# EAGLE schematic AcceLog_v00 (EAGLE 7.3.0)
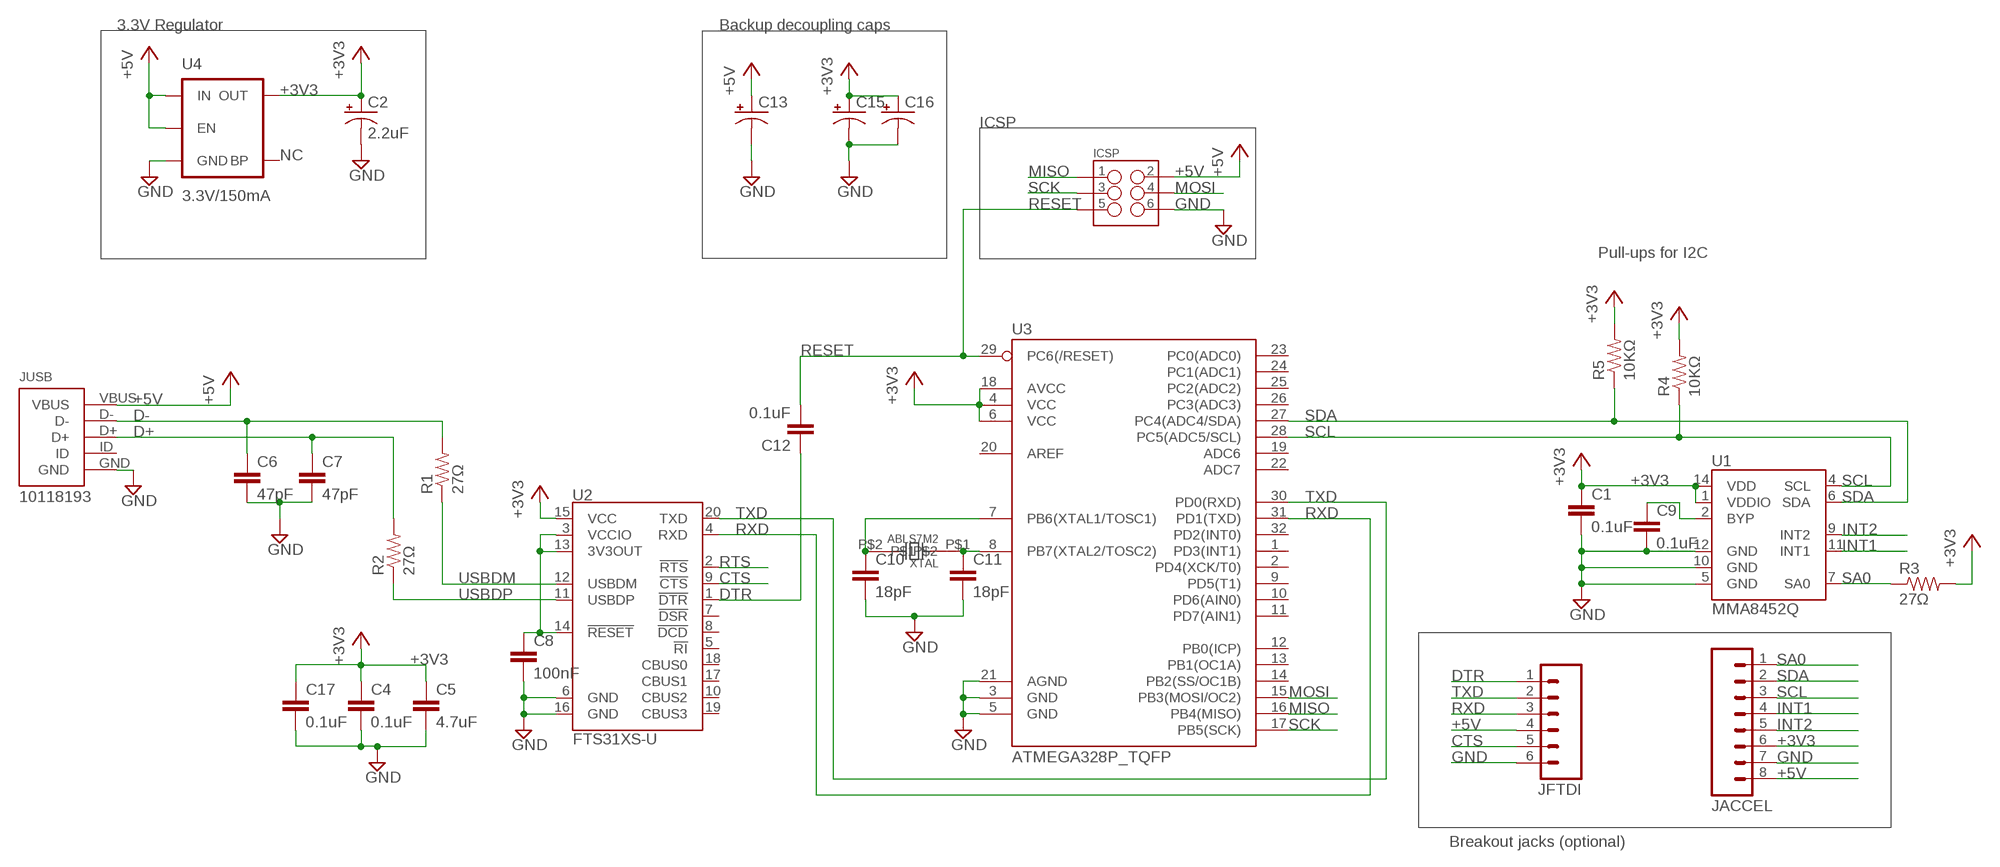
[diagram p0: schematic, sheet 1]

## Parts
C1  0.1uF  CAP0603-CAP  [0603-CAP]
C2  2.2uF  CAP_POL1206  [EIA3216]
C4  0.1uF  CAP0603-CAP  [0603-CAP]
C5  4.7uF  CAP0603-CAP  [0603-CAP]
C6  47pF  CAP0603-CAP  [0603-CAP]
C7  47pF  CAP0603-CAP  [0603-CAP]
C8  100nF  CAP0603-CAP  [0603-CAP]
C9  0.1uF  CAP0603-CAP  [0603-CAP]
C10  18pF  CAP0603-CAP  [0603-CAP]
C11  18pF  CAP0603-CAP  [0603-CAP]
C12  0.1uF  CAP0603-CAP  [0603-CAP]
C13  CPOL-USE2-5  [E2-5]
C15  CPOL-USE2-5  [E2-5]
C16  CPOL-USE2-5  [E2-5]
C17  0.1uF  CAP0603-CAP  [0603-CAP]
ICSP  M03X22X3_SILK_MALE_PTH  [2X3]
JACCEL  M08LOCK  [1X08_LOCK]
JFTDI  M06LOCK  [1X06_LOCK]
JUSB  10118193  [10118193]
R1  27Ω  RESISTOR0603-RES  [0603-RES]
R2  27Ω  RESISTOR0603-RES  [0603-RES]
R3  27Ω  RESISTOR0603-RES  [0603-RES]
R4  10KΩ  RESISTOR0603-RES  [0603-RES]
R5  10KΩ  RESISTOR0603-RES  [0603-RES]
U1  MMA8452Q  [QFN-16_0.5MM]
U2  FTS31XS-U  FT231XS  [SSOP20_L]
U3  ATMEGA328P_TQFP  [TQFP32-08]
U4  3.3V/150mA  V_REG_MIC52053.3V  [SOT23-5]
XTAL  ABLS7M2  [ABLS7M2]

## Nets
+3V3: C1.1 C2.A(+) C4.1 C5.1 C15.+ C16.+ C17.1 JACCEL.6 R3.2 R4.2 R5.2 U1.1(VDDIO) U1.14(VDD) U2.15(VCC) U3.4(VCC) U3.6(VCC) U3.18(AVCC) U4.5(OUT)
+5V: C13.+ ICSP.2 JACCEL.8 JFTDI.4 JUSB.VBUS U4.1(IN) U4.3(EN)
CTS: JFTDI.5 U2.9(!CTS)
D+: C7.1 JUSB.D+ R2.2
D-: C6.1 JUSB.D- R1.2
DTR: C12.1 JFTDI.1 U2.1(!DTR)
FTDI3V3: C8.1 U2.3(VCCIO) U2.13(3V3OUT) U2.14(!RESET)
GND: C1.2 C2.C(-) C4.2 C5.2 C6.2 C7.2 C8.2 C9.2 C10.2 C11.2 C13.- C15.- C16.- C17.2 ICSP.6 JACCEL.7 JFTDI.6 JUSB.GND U1.5(GND) U1.10(GND) U1.12(GND) U2.6(GND) U2.16(GND) U3.3(GND) U3.5(GND) U3.21(AGND) U4.2(GND)
INT1: JACCEL.4 U1.11(INT1)
INT2: JACCEL.5 U1.9(INT2)
MISO: ICSP.1 U3.16(PB4(MISO))
MOSI: ICSP.4 U3.15(PB3(MOSI/OC2))
N$10: C10.1 U3.7(PB6(XTAL1/TOSC1)) XTAL.P$2
N$11: C9.1 U1.2(BYP)
N$12: C11.1 U3.8(PB7(XTAL2/TOSC2)) XTAL.P$1
RESET: C12.2 ICSP.5 U3.29(PC6(/RESET))
RTS: U2.2(!RTS)
RXD: JFTDI.3 U2.4(RXD) U3.31(PD1(TXD))
SA0: JACCEL.1 R3.1 U1.7(SA0)
SCK: ICSP.3 U3.17(PB5(SCK))
SCL: JACCEL.3 R4.1 U1.4(SCL) U3.28(PC5(ADC5/SCL))
SDA: JACCEL.2 R5.1 U1.6(SDA) U3.27(PC4(ADC4/SDA))
TXD: JFTDI.2 U2.20(TXD) U3.30(PD0(RXD))
USBDM: R1.1 U2.12(USBDM)
USBDP: R2.1 U2.11(USBDP)
Unconnected: JUSB.ID U2.5(!RI) U2.7(!DSR) U2.8(!DCD) U2.10(CBUS2) U2.17(CBUS1) U2.18(CBUS0) U2.19(CBUS3) U3.1(PD3(INT1)) U3.2(PD4(XCK/T0)) U3.9(PD5(T1)) U3.10(PD6(AIN0)) U3.11(PD7(AIN1)) U3.12(PB0(ICP)) U3.13(PB1(OC1A)) U3.14(PB2(SS/OC1B)) U3.19(ADC6) U3.20(AREF) U3.22(ADC7) U3.23(PC0(ADC0)) U3.24(PC1(ADC1)) U3.25(PC2(ADC2)) U3.26(PC3(ADC3)) U3.32(PD2(INT0)) U4.4(BP)

## Notes on the sheet
- 3.3V Regulator | Backup decoupling caps
- ICSP
- NC
- Pull-ups for I2C
- Breakout jacks (optional)

## Library data of the parts
C1 C4-C12 C17 = SparkFun-Passives:CAP: Capacitor Standard 0603 ceramic capacitor, and 0.1" leaded capacitor.
C2 = SparkFun-Capacitors:CAP_POL: Capacitor Polarized These are standard SMD and PTH capacitors. Normally 10uF, 47uF, and 100uF in electrolytic and tantalum varieties. Always verify the external diameter of the through hole cap, it varies with capacity, voltage, and manufacturer. The EIA devices should be standard.
C13 C15 C16 = rcl:CPOL-US: POLARIZED CAPACITOR, American symbol
ICSP = SparkFun-Connectors:M03X2: 2x3 .1" header. Shrouded, with keying- CONN-10681 SMT- CONN-11415 Pogo pins- HW-11044; PROD_ID: CONN-09701
JACCEL = SparkFun-Connectors:M08: Header 8 Standard 8-pin 0.1" header. Use with straight break away headers (SKU : PRT-00116), right angle break away headers (PRT-00553), swiss pins (PRT-00743), machine pins (PRT-00117), and female headers (PRT-00115).
JFTDI = SparkFun-Connectors:M06: Header 6 Standard 6-pin 0.1" header. Use with straight break away headers (SKU : PRT-00116), right angle break away headers (PRT-00553), swiss pins (PRT-00743), machine pins (PRT-00117), and female headers (PRT-00115). Molex polarized connector foot print use with SKU : PRT-08094 with associated crimp pins and housings. NOTES ON THE VARIANTS LOCK and LOCK_LONGPADS... This footprint was designed to help hold the alignment of a through-hole component (i.e. 6-pin header) while soldering it into place. You may notice that each hole has been shifted either up or down by 0.005 of an inch from it's more standard position (which is a perfectly straight line). This slight alteration caused the pins (the squares in the middle) to touch the edges of the holes. Because they are alternating, it causes a "brace" to hold the component in place. 0.005 has proven to be the perfect amount of "off-center" position when using our standard breakaway headers. Although looks a little odd when you look at the bare footprint, once you have a header in there, the alteration is very hard to notice. Also,if you push a header all the way into place, it is covered up entirely on the bottom side. This idea of altering the position of holes to aid alignment will be further integrated into the Sparkfun Library for other footprints. It can help hold any component with 3 or more connection pins.
JUSB = MicroUSB:10118193: Micro USB B Jack for Surface Mount; MPN: 10118193; OC_DIGIKEY: 609-4616-1-ND; WEBSITE: http://www.digikey.com/product-detail/en/10118193-0001LF/609-4616-1-ND/2785380
R1-R5 = SparkFun-Passives:RESISTOR: Resistor Basic schematic elements and footprints for 0603, 1206, and PTH resistors.
U1 = SparkFun-Sensors:MMA8452Q: MMA8452Q 3-Axis, 12/8-bit Digital Accelerometer Supply Voltage: 1.6-3.6V Range: +/- 2g, 4g, 8g Interface: I2C, 12-bit and 8-bit ODR: 1.56 Hz - 800 Hz Package: QFN-16 http://cache.freescale.com/files/sensors/doc/data_sheet/MMA8452Q.pdf; PROD_ID: IC-10769
U2 = SparkFun-DigitalIC:FT231X: FTDI FT231X Full Speed USB to Full-handshake UART This USB2.0 Full Speed IC offers a compact bridge to full handshake UART interfaces. The device is a UART, capable of operating up to 3MBaud, with low power consumption (8mA). The FT231X includes the complete FT-X series feature set and enables USB to be added into a system design quickly and easily over a UART interface.; PROD_ID: IC-11524
U3 = SparkFun-DigitalIC:ATMEGA328P_TQFP; PROD_ID: IC-09069
U4 = SparkFun-PowerIC:V_REG_MIC5205: V_REG MIC5205 Standard 3.3V, 5V, and Adjustable 150mA LDO voltage regulator in SOT-23 layout. Micrel part MIC5205. BP (by-pass) pin is used to lower output noise with 470pF cap, may be left open. On the adjustable version BP is used to set output.; PROD_ID: VREG-00822
XTAL = AcceLogLib:ABLS7M2; DIGIKEY: 535-12830-1-ND; WEBSITE: http://www.digikey.com/product-detail/en/ABLS7M2-16.000MHZ-D-2Y-T/535-12830-1-ND/5135076